# Altium schematic sheet 1_main.schdoc
size 302 x 215 mm
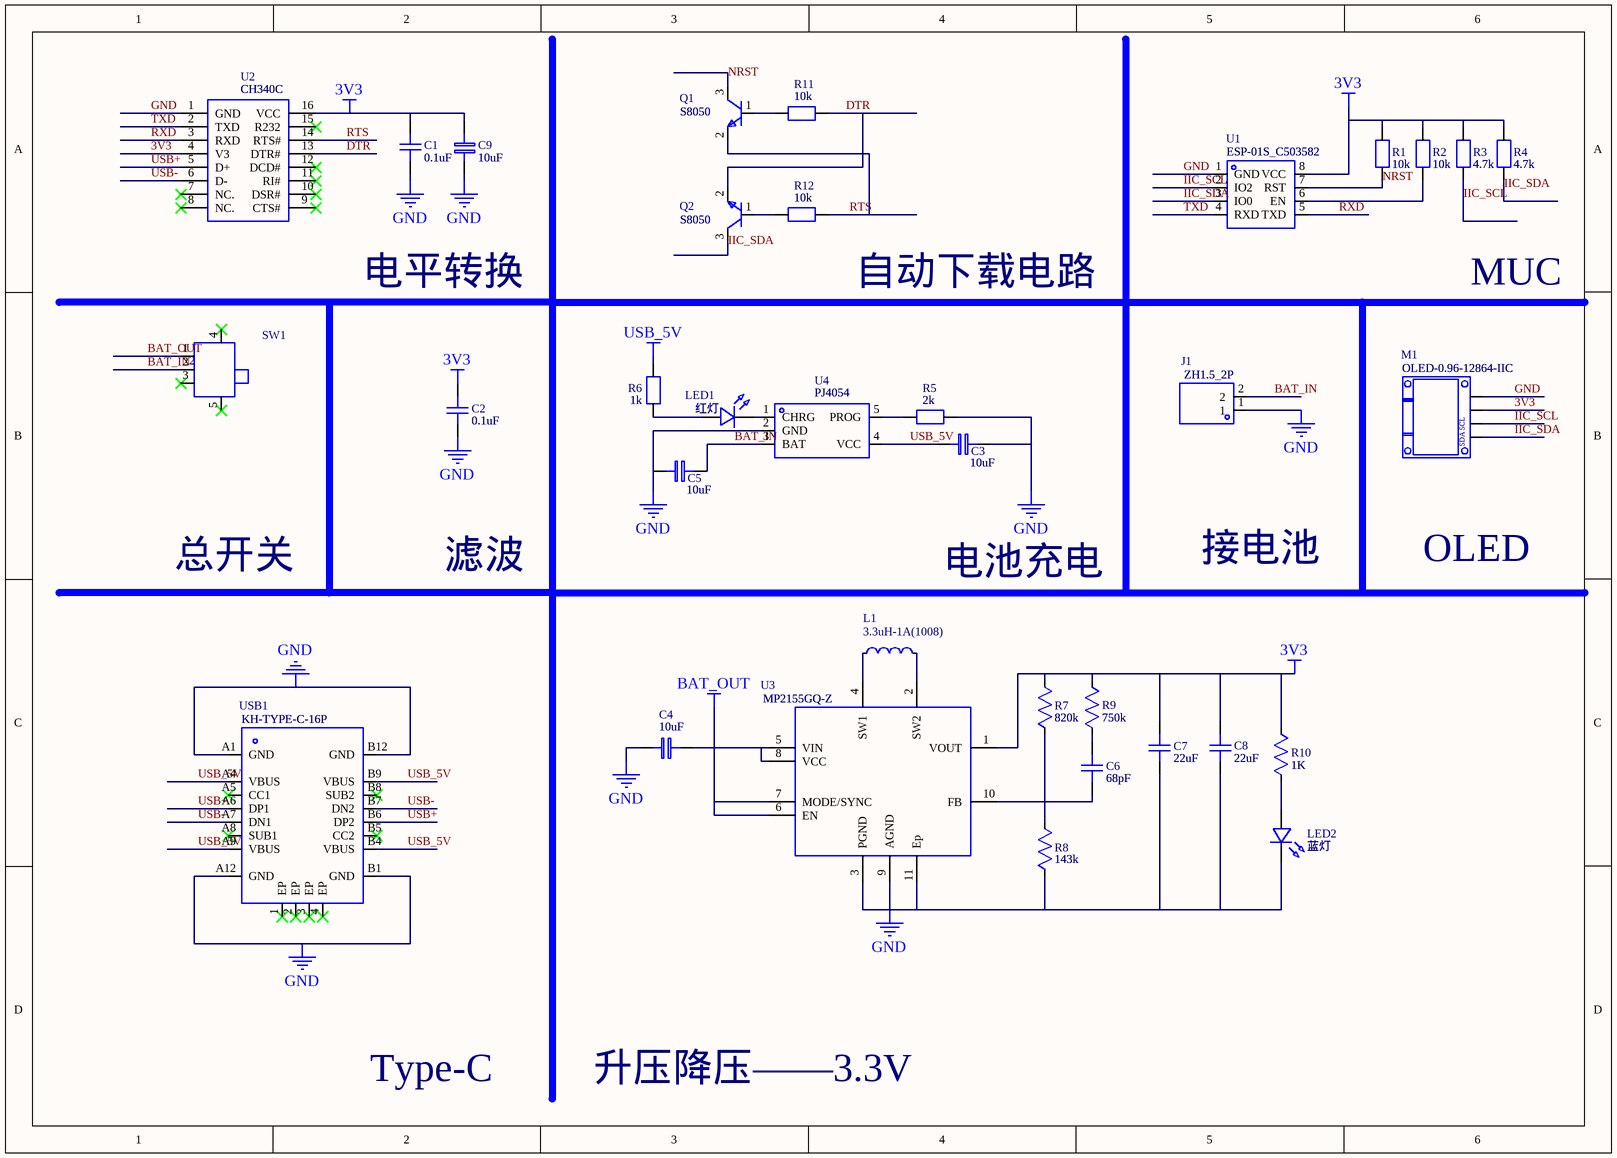
[diagram p0: 1_main.schdoc]

## Parts
C1  0.1uF  [C0805]
C2  0.1uF  [C0805]
C3  10uF  [C0805]
C4  10uF  [C0805]
C5  10uF  [C0805]
C6  68pF  [C0805]
C7  22uF  [C0805]
C8  22uF  [C0805]
C9  10uF  [C0805]
J1  ZH1.5_2P  [CONN-TH_B2B-ZR-3.4-LF-SN]
L1  value 3.3uH-1A(1008)
LED1  红灯  [LED0805_RED]
LED2  蓝灯  [LED0805_BLUE]
M1  OLED-0.96-12864-IIC  [OLED-0.96-12864-IIC_4PIN]
Q1  S8050  [SOT-23-3_L2.9-W1.3-P1.90-LS2.4-BR]
Q2  S8050  [SOT-23-3_L2.9-W1.3-P1.90-LS2.4-BR]
R1  10k  [R0805]
R2  10k  [R0805]
R3  4.7k  [R0805]
R4  4.7k  [R0805]
R5  2k  [R0805]
R6  1k  [R0805]
R7  820k  [R0805]
R8  143k  [R0805]
R9  750k  [R0805]
R10  1K  [R0805]
R11  10k  [R0805]
R12  10k  [R0805]
SW1  NUMBER: 2  [SW-TH_SK12D07VG6]
U1  ESP-01S_C503582  [WIFIM-TH_8P-L24.7-W14.4-P2.54]
U2  CH340C  [SOP-16_L10.0-W3.9-P1.27-LS6.0-BL]
U3  MP2155GQ-Z  [QFN-10_L3.0-W3.0-P0.50-LS3.0-BL-EP]
U4  PJ4054  [SOT-23-5_L3.0-W1.7-P0.95-LS2.8-TL]
USB1  KH-TYPE-C-16P  [USB-C-SMD_KH-TYPE-C-16P]

## Nets
3V3: C1.2 C2.2 C7.2 C8.2 C9.2 M1.2(VCC) R1.2 R2.2 R3.2 R4.2 R7.2 R9.2 R10.2 U1.8(VCC) U2.4(V3) U2.16(VCC) U3.1(VOUT)
BAT_OUT: C4.2 SW1.1 U3.5(VIN) U3.6(EN) U3.7(MODE/SYNC) U3.8(VCC)
GND: C1.1 C2.1 C3.2 C4.1 C5.1 C7.1 C8.1 C9.1 J1.1 LED2.2 M1.1(GND) R5.2 R8.1 U1.1(GND) U2.1(GND) U3.3(PGND) U3.9(AGND) U3.11(Ep) U4.2(GND) USB1.A1(GND) USB1.A12(GND) USB1.B1(GND) USB1.B12(GND)
USB_5V: C3.1 R6.2 U4.4(VCC) USB1.A4(VBUS) USB1.A9(VBUS) USB1.B4(VBUS) USB1.B9(VBUS)
BAT_IN: C5.2 J1.2 SW1.2 U4.3(BAT)
DTR: Q2.2 R11.2 U2.13(DTR#)
IIC_SCL: M1.3(SCL) R3.1 U1.2(IO2)
IIC_SDA: M1.4(SDA) Q2.3 R4.1 U1.3(IO0)
NRST: Q1.3 R1.1 U1.7(RST)
RTS: Q1.2 R12.2 U2.14(RTS#)
RXD: U1.5(TXD) U2.3(RXD)
TXD: U1.4(RXD) U2.2(TXD)
USB+: U2.5(D+) USB1.A6(DP1) USB1.B6(DP2)
USB-: U2.6(D-) USB1.A7(DN1) USB1.B7(DN2)
NetC6_1: C6.1 R7.1 R8.2 U3.10(FB)
NetC6_2: C6.2 R9.1
NetL1_1: L1.1 U3.4(SW1)
NetL1_2: L1.2 U3.2(SW2)
NetLED1_1: LED1.1 R6.1
NetLED1_2: LED1.2 U4.1(CHRG)
NetLED2_1: LED2.1 R10.1
NetQ1_1: Q1.1 R11.1
NetQ2_1: Q2.1 R12.1
NetR2_1: R2.1 U1.6(EN)
NetR5_1: R5.1 U4.5(PROG)

Not connected (* = marked no-connect by the designer): SW1 3* 4* 5*; U2 7(NC.)* 8(NC.)* 9(CTS#)* 10(DSR#)* 11(RI#)* 12(DCD#)* 15(R232)*; USB1 1(EP)* 2(EP)* 3(EP)* 4(EP)* A5(CC1)* A8(SUB1)* B5(CC2)* B8(SUB2)*

## Notes on the sheet
- 电平转换
- 自动下载电路
- MUC
- 总开关
- 滤波
- 接电池
- OLED
- 电池充电
- Type-C
- 升压降压——3.3V

## Library data of the parts
C1 = 0.1uF: Convert to PCB: yes; Symbol: 0.1uF; Name: 0.1uF; Device: 0.1uF; Add into BOM: yes; Origin Footprint: C0805
C2 = 0.1uF_C0805: Convert to PCB: yes; Symbol: 0.1uF; Name: 0.1uF; Device: 0.1uF_C0805; Add into BOM: yes; Origin Footprint: C0805
C3 = 10uF: Convert to PCB: yes; Symbol: 10uF; Name: 10uF; Device: 10uF; Add into BOM: yes; Origin Footprint: C0805
C4 C5 C9 = 10uF_C0805: Convert to PCB: yes; Symbol: 10uF; Name: 10uF; Device: 10uF_C0805; Add into BOM: yes; Origin Footprint: C0805
C6 = 68pF: Convert to PCB: yes; Symbol: 68pF; Name: 68pF; Device: 68pF; Add into BOM: yes; Origin Footprint: C0805
C7 = 22uF: Convert to PCB: yes; Symbol: 22uF; Name: 22uF; Device: 22uF; Add into BOM: yes; Origin Footprint: C0805
C8 = 22uF_C0805: Convert to PCB: yes; Symbol: 22uF; Name: 22uF; Device: 22uF_C0805; Add into BOM: yes; Origin Footprint: C0805
J1 = ZH1.5_2P: Manufacturer: JST Sales America; Convert to PCB: yes; Symbol: ZH1.5_2P; Name: ZH1.5_2P; Device: ZH1.5_2P; Supplier: LCSC; Supplier Part: C163033; Manufacturer Part: -; JLCPCB Part Class: Extended Part; Add into BOM: yes; Origin Footprint: CONN-TH_B2B-ZR-3.4-LF-SN
L1 = L_0402: Symbol: SDCL1005C10NJTDFM01; Add into BOM: yes; Description: 电感值:10nH;精度:±5%;额定电流:300mA;饱和电流(Isat):-;直流电阻(DCR):400mΩ;; Device: L_0402; Supplier Footprint: L0402; Convert to PCB: yes; Supplier Part: C560042
LED1 = 红灯: Manufacturer: EVERLIGHT(台湾亿光); Manufacturer Part: 17-21SURC/S530-A3/TR8; Convert to PCB: yes; Symbol: 红灯; Name: 红灯; Device: 红灯; Supplier Part: C72037; Add into BOM: yes; Origin Footprint: LED0805_RED
LED2 = 蓝灯: Manufacturer: 方舟 ARKLED; Manufacturer Part: D-B080508B1-KS2; Convert to PCB: yes; Symbol: 蓝灯; Name: 蓝灯; Device: 蓝灯; Supplier Part: C108412; Add into BOM: yes; Origin Footprint: LED0805_BLUE
M1 = OLED-0.96-12864-IIC: Convert to PCB: yes; Symbol: OLED-0.96-12864-IIC; Name: OLED-0.96-12864-IIC; Device: OLED-0.96-12864-IIC; Supplier: 中景园; Supplier Part: ZJY096I0400WG11; link: https://item.taobao.com/item.htm?spm=a1z0d.7625083.1998302264.6.5c5f4e69gtEY0J&amp;id=565003560570; Add into BOM: yes; Origin Footprint: OLED-0.96-12864-IIC_4PIN
Q1 = S8050: Manufacturer: FOSAN(富信); Convert to PCB: yes; Symbol: S8050; Name: S8050; Device: S8050; Supplier: LCSC; Supplier Part: C2926165; Manufacturer Part: S8050; JLCPCB Part Class: Extended Part; Add into BOM: yes; Origin Footprint: SOT-23-3_L2.9-W1.3-P1.90-LS2.4-BR
Q2 = S8050_SOT-23-3_L2.9-W1.3-P1.90-LS2.4-BR: Manufacturer: FOSAN(富信); Symbol: S8050(1); Convert to PCB: yes; Name: S8050; Device: S8050_SOT-23-3_L2.9-W1.3-P1.90-LS2.4-BR; Supplier: LCSC; Supplier Part: C2926165; Manufacturer Part: S8050; JLCPCB Part Class: Extended Part; Add into BOM: yes; Origin Footprint: SOT-23-3_L2.9-W1.3-P1.90-LS2.4-BR
R1 R11 R12 = 10k_R0805: Convert to PCB: yes; Symbol: 10k; Name: 10k; Device: 10k_R0805; Add into BOM: yes; Origin Footprint: R0805
R2 = 10k: Convert to PCB: yes; Symbol: 10k; Name: 10k; Device: 10k; Add into BOM: yes; Origin Footprint: R0805
R3 = 4.7k: Convert to PCB: yes; Symbol: 4.7k; Name: 4.7k; Device: 4.7k; Add into BOM: yes; Origin Footprint: R0805
R4 = 4.7k_R0805: Convert to PCB: yes; Symbol: 4.7k; Name: 4.7k; Device: 4.7k_R0805; Add into BOM: yes; Origin Footprint: R0805
R5 = 2k: Convert to PCB: yes; Symbol: 2k; Name: 2k; Device: 2k; Add into BOM: yes; Origin Footprint: R0805
R6 = 1k: Convert to PCB: yes; Symbol: 1k; Name: 1k; Device: 1k; Add into BOM: yes; Origin Footprint: R0805
R7 = 820k: Convert to PCB: yes; Symbol: 820k; Name: 820k; Device: 820k; Add into BOM: yes; Origin Footprint: R0805
R8 = 143k: Convert to PCB: yes; Symbol: 143k; Name: 143k; Device: 143k; Add into BOM: yes; Origin Footprint: R0805
R9 = 750k: Convert to PCB: yes; Symbol: 750k; Name: 750k; Device: 750k; Add into BOM: yes; Origin Footprint: R0805
R10 = 1K_R0805: Symbol: 1K(1); Convert to PCB: yes; Name: 1K; Device: 1K_R0805; Add into BOM: yes; Origin Footprint: R0805
SW1 = SK12D07VG6: Manufacturer: SHOU HAN(首韩); Add into BOM: yes; Symbol: SK12D07VG6; Device: SK12D07VG6; LCSC Part Name: 3脚2两档位SK12D07VG6 1P2T卧式拨动开关,柄长6MM; Supplier Part: C2681575; Manufacturer Part: SK12D07VG6; Supplier Footprint: 插件; JLCPCB Part Class: Extended Part; Datasheet: https://atta.szlcsc.com/upload/public/pdf/source/20210224/C2681575_3012D31310882582C75C81102188B09E.pdf; Supplier: LCSC; Convert to PCB: yes
U1 = ESP-01S_C503582: Manufacturer: Ai-Thinker; Convert to PCB: yes; Symbol: ESP-01S_C503582; Name: ESP-01S_C503582; Device: ESP-01S_C503582; Supplier: LCSC; Supplier Part: C503582; Manufacturer Part: ESP-01S; JLCPCB Part Class: Extended Part; Add into BOM: yes; Origin Footprint: WIFIM-TH_8P-L24.7-W14.4-P2.54
U2 = CH340C: Manufacturer: WCH; Convert to PCB: yes; Symbol: CH340C; Name: CH340C; Device: CH340C; Supplier: LCSC; Manufacturer Part: CH340C; Supplier Part: C84681; JLCPCB Part Class: Extended Part; Add into BOM: yes; Origin Footprint: SOP-16_L10.0-W3.9-P1.27-LS6.0-BL
U3 = MP2155GQ-Z: Manufacturer: MPS; Convert to PCB: yes; Symbol: MP2155GQ-Z; Name: MP2155GQ-Z; Device: MP2155GQ-Z; Supplier: LCSC; Manufacturer Part: MP2155GQ-Z; Supplier Part: C110397; JLCPCB Part Class: Extended Part; Add into BOM: yes; Origin Footprint: QFN-10_L3.0-W3.0-P0.50-LS3.0-BL-EP
U4 = PJ4054: Manufacturer: PJ(Pingjingsemi); Convert to PCB: yes; Symbol: PJ4054; Name: PJ4054; Device: PJ4054; Supplier: LCSC; Supplier Part: C440262; Manufacturer Part: PJ4054; JLCPCB Part Class: Extended Part; Add into BOM: yes; Origin Footprint: SOT-23-5_L3.0-W1.7-P0.95-LS2.8-TL
USB1 = KH-TYPE-C-16P: Manufacturer: Shenzhen Kinghelm Elec; Convert to PCB: yes; Symbol: KH-TYPE-C-16P; Name: KH-TYPE-C-16P; Device: KH-TYPE-C-16P; Supplier: LCSC; Supplier Part: C709357; Manufacturer Part: KH-TYPE-C-16P; JLCPCB Part Class: Extended Part; Add into BOM: yes; Origin Footprint: USB-C-SMD_KH-TYPE-C-16P